# Altium schematic sheet Wristband-v3.SchDoc
size A; Revision: 1.2; DocumentName: Wristband-HW
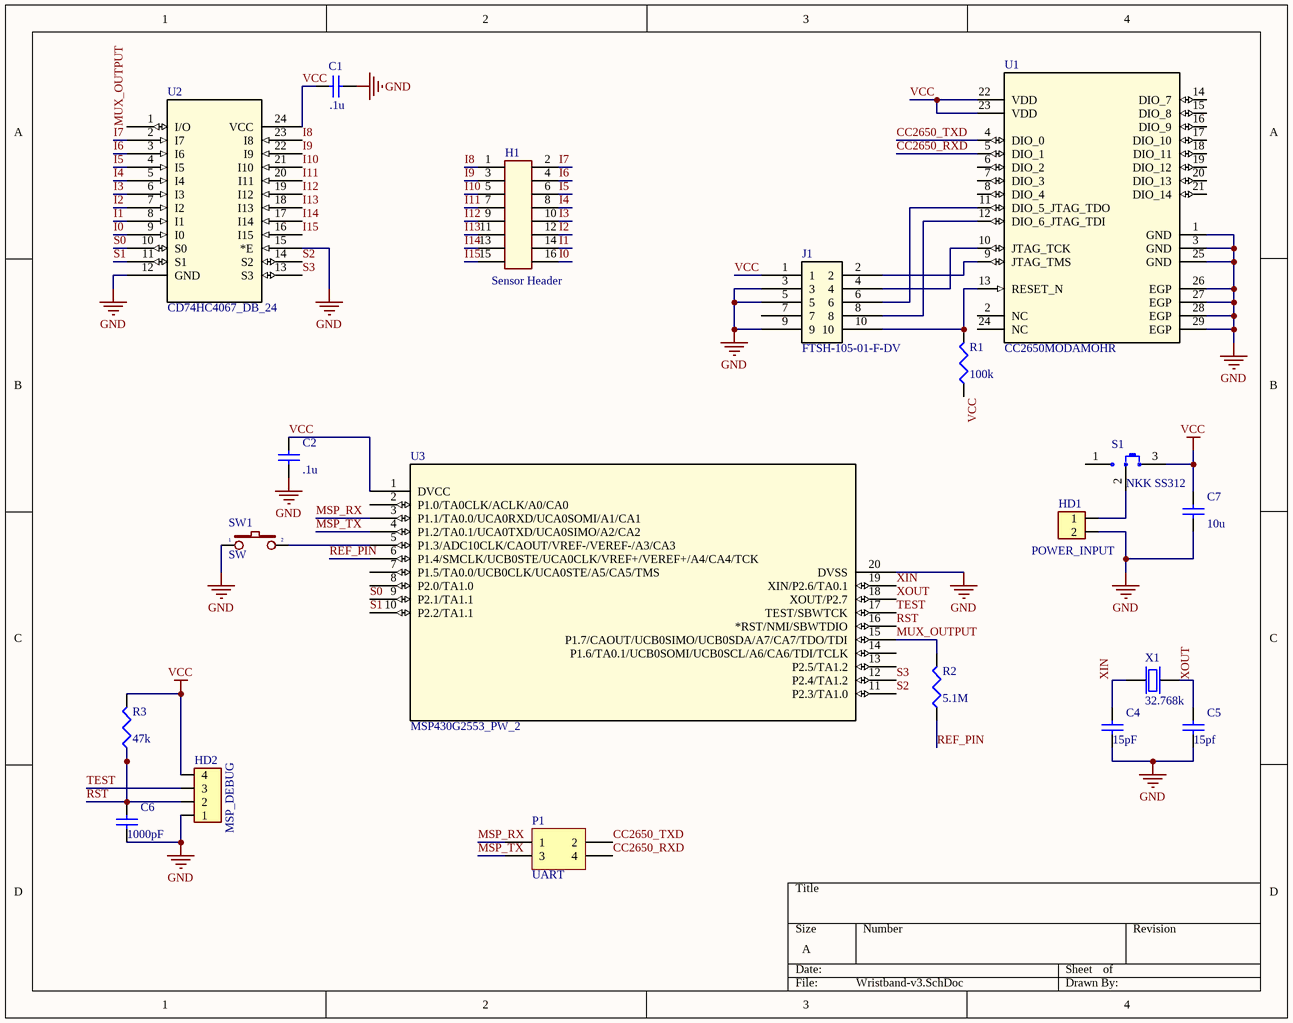
[diagram p0: Wristband-v3.SchDoc]

## Parts
C1  value .1u  [1608[0603]]
C2  value .1u  [1608[0603]]
C4  value 15pF  [1608[0603]]
C5  value 15pf  [1608[0603]]
C6  value 1000pF  [1608[0603]]
C7  value 10u  [1608[0603]]
H1  Sensor Header  [HD_male_8x2_100mil_straight]
HD1  POWER_INPUT  [HD_MALE_2]
HD2  MSP_DEBUG  [HD_MALE_4]
J1  FTSH-105-01-F-DV  [FTSH-105-01-F-DV]
P1  UART  [HDR2X2]
R1  value 100k  [J1-0603]
R2  value 5.1M  [J1-0603]
R3  value 47k  [J1-0603]
S1  NKK SS312  [NKK SS312SAH4]
SW1  SW  [SW2]
U1  CC2650MODAMOHR  [MOH0029A]
U2  CD74HC4067_DB_24  [DB0024A_L]
U3  MSP430G2553_PW_2  [PW20]
X1  value 32.768k  [ABRACON ABS06]  (hidden comment: Crystal 32.768 k)

## Nets
GND: C1.1 C2.1 C4.1 C5.1 C6.1 C7.1 HD1.2 HD2.1 J1.3 J1.5 J1.9 SW1.1 U1.1(GND) U1.3(GND) U1.25(GND) U1.26(EGP) U1.27(EGP) U1.28(EGP) U1.29(EGP) U2.12(GND) U2.15(*E) U3.20(DVSS)
VCC: C1.2 C2.2 C7.2 HD2.4 J1.1 R1.1 R3.2 S1.3 U1.22(VDD) U1.23(VDD) U2.24(VCC) U3.1(DVCC)
CC2650_RXD: P1.4 U1.5(DIO_1)
CC2650_TXD: P1.2 U1.4(DIO_0)
I0: H1.16 U2.9(I0)
I1: H1.14 U2.8(I1)
I2: H1.12 U2.7(I2)
I3: H1.10 U2.6(I3)
I4: H1.8 U2.5(I4)
I5: H1.6 U2.4(I5)
I6: H1.4 U2.3(I6)
I7: H1.2 U2.2(I7)
I8: H1.1 U2.23(I8)
I9: H1.3 U2.22(I9)
I10: H1.5 U2.21(I10)
I11: H1.7 U2.20(I11)
I12: H1.9 U2.19(I12)
I13: H1.11 U2.18(I13)
I14: H1.13 U2.17(I14)
I15: H1.15 U2.16(I15)
MSP_RX: P1.1 U3.3(P1.1/TA0.0/UCA0RXD/UCA0SOMI/A1/CA1)
MSP_TX: P1.3 U3.4(P1.2/TA0.1/UCA0TXD/UCA0SIMO/A2/CA2)
MUX_OUTPUT: R2.2 U2.1(I/O) U3.15(P1.7/CAOUT/UCB0SIMO/UCB0SDA/A7/CA7/TDO/TDI)
REF_PIN: R2.1 U3.6(P1.4/SMCLK/UCB0STE/UCA0CLK/VREF+/VEREF+/A4/CA4/TCK)
RST: C6.2 HD2.2 R3.1 U3.16(*RST/NMI/SBWTDIO)
S0: U2.10(S0) U3.9(P2.1/TA1.1)
S1: U2.11(S1) U3.10(P2.2/TA1.1)
S2: U2.14(S2) U3.11(P2.3/TA1.0)
S3: U2.13(S3) U3.12(P2.4/TA1.2)
TEST: HD2.3 U3.17(TEST/SBWTCK)
XIN: C4.2 U3.19(XIN/P2.6/TA0.1) X1.1(Xin)
XOUT: C5.2 U3.18(XOUT/P2.7) X1.2(Xout)
NetHD1_1: HD1.1 S1.2(COM)
NetJ1_2: J1.2 U1.9(JTAG_TMS)
NetJ1_4: J1.4 U1.10(JTAG_TCK)
NetJ1_6: J1.6 U1.11(DIO_5_JTAG_TDO)
NetJ1_8: J1.8 U1.12(DIO_6_JTAG_TDI)
NetJ1_10: J1.10 R1.2 U1.13(RESET_N)
NetSW1_2: SW1.2 U3.5(P1.3/ADC10CLK/CAOUT/VREF-/VEREF-/A3/CA3)

Not connected (* = marked no-connect by the designer): J1 7; S1 1; U1 2(NC) 6(DIO_2) 7(DIO_3) 8(DIO_4) 14(DIO_7) 15(DIO_8) 16(DIO_9) 17(DIO_10) 18(DIO_11) 19(DIO_12) 20(DIO_13) 21(DIO_14) 24(NC); U3 2(P1.0/TA0CLK/ACLK/A0/CA0) 7(P1.5/TA0.0/UCB0CLK/UCA0STE/A5/CA5/TMS) 8(P2.0/TA1.0) 13(P2.5/TA1.2) 14(P1.6/TA0.1/UCB0SOMI/UCB0SCL/A6/CA6/TDI/TCLK)

## Library data of the parts
C1 C2 C4-C7 = Cap Semi: Capacitor (Semiconductor SIM Model); Published: 8-Jun-2000; LatestRevisionDate: 29-May-2009; LatestRevisionNote: IPC-7351 Footprint Added.; PackageReference: C1206; Publisher: Altium Limited; PackageDescription: Chip Capacitor
H1 = HD_8x2: Header, 8-pins/row, double row,
HD1 = HD_2: Header single row 2 pins
HD2 = HD_4: Header single row 4 pins
J1 = FTSH-105-01-F-DV: Imported; Manufacturer_Part_Number: FTSH-105-01-F-DV-K; Vendor: Samtec; C: Copyright (C) 2016 Accelerated Designs. All rights reserved; Copyright: Copyright (C) 2016 Accelerated Designs. All rights reserved; Value: Value; Type: Type; RefDes: RefDes
P1 = Header 2X2: Header, 2-Pin, Dual row; LatestRevisionDate: 17-Jul-2002; LatestRevisionNote: Re-released for DXP Platform.; Publisher: Altium Limited
R1-R3 = Res3: Resistor; Published: 8-Jun-2000; LatestRevisionDate: 29-May-2009; LatestRevisionNote: IPC-7351 Footprint Added.; PackageReference: J1-0603; Publisher: Altium Limited; PackageDescription: Chip Resistor
SW1 = SW2: Switch button 2 pin; Value: SW chip 2 pin
U1 = CC2650MODAMOHR: Imported; Manufacturer: Texas Instruments; PartNumber: CC2650MODAMOHR; RefDes: RefDes; TYPE: TYPE; Value: Value
U2 = CD74HC4067_DW_24: Imported; Manufacturer: Texas Instruments; INDUSTRY_STD_PKG_TYPE: SOIC; FAMILY_NAME: ANALOG SWITCH/MULTIPLEXER(less than or equal to 5V); PIN_COUNT: 24; PACKAGE_DESIGNATOR: DW; Datasheet_URL: http://www.ti.com/lit/gpn/CD74HC4067; GENERIC_PART_NUMBER: CD74HC4067; Value: Value; Type: Type; RefDes: RefDes
U3 = MSP430G2553_PW_2: Imported; Manufacturer_Part_Number: msp430g2553_pw_20; Vendor: Texas Instruments; PACKAGE_DESIGNATOR: PW; PIN_COUNT: 20; FAMILY_NAME: Value Line; INDUSTRY_STD_PKG_TYPE: TSSOP; GENERIC_PART_NUMBER: MSP430G2553; Manufacturer: Texas Instruments; Datasheet_URL: http://www.ti.com/lit/gpn/MSP430G2553; Value: Value; Type: Type; RefDes: RefDes
X1 = XT32k